# Altium schematic sheet Sheet_IRFS7530_bridges.SchDoc
size A
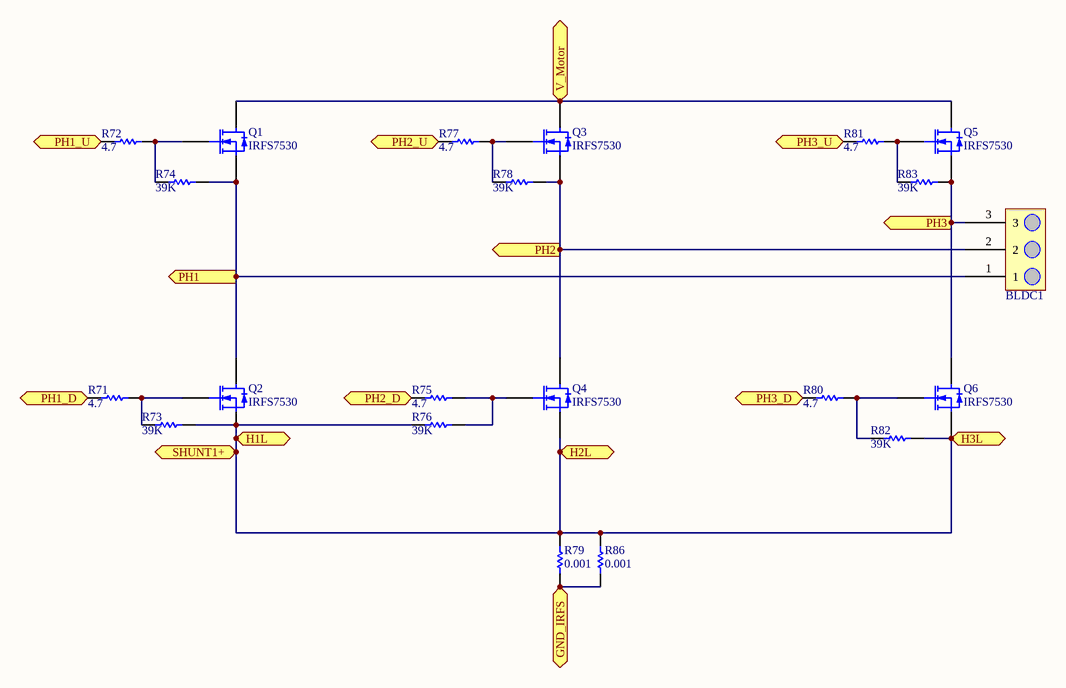
[diagram p0: Sheet_IRFS7530_bridges.SchDoc]

## Parts
BLDC1  Terminal3  [TERM3]  (value not drawn)
Q1  IRFS7530  [D2PAK-7Pin]
Q2  IRFS7530  [D2PAK-7Pin]
Q3  IRFS7530  [D2PAK-7Pin]
Q4  IRFS7530  [D2PAK-7Pin]
Q5  IRFS7530  [D2PAK-7Pin]
Q6  IRFS7530  [D2PAK-7Pin]
R71  4.7  [1608[0603]]
R72  4.7  [1608[0603]]
R73  39K  [1608[0603]]
R74  39K  [1608[0603]]
R75  4.7  [1608[0603]]
R76  39K  [1608[0603]]
R77  4.7  [1608[0603]]
R78  39K  [1608[0603]]
R79  0.001  [5931]
R80  4.7  [1608[0603]]
R81  4.7  [1608[0603]]
R82  39K  [1608[0603]]
R83  39K  [1608[0603]]
R86  0.001  [5931]

## Ports
GND_IRFS (bidir), H1L (out), H2L (out), H3L (out), PH1 (out), PH1_D (in), PH1_U (in), PH2 (out), PH2_D (in), PH2_U (in), PH3 (out), PH3_D (in), PH3_U (in), SHUNT1+ (out), V_Motor (bidir)

## Nets
GND_IRFS: R79.1 R86.1 ; port GND_IRFS
H1L: Q2.3(S) Q4.3(S) Q6.3(S) R73.2 R76.1 R79.2 R82.2 R86.2 ; port H1L, port SHUNT1+, port H2L, port H3L
PH1: BLDC1.1 Q1.3(S) Q2.2(D) R74.2 ; port PH1
PH1_D: R71.1 ; port PH1_D
PH1_U: R72.1 ; port PH1_U
PH2: BLDC1.2 Q3.3(S) Q4.2(D) R78.2 ; port PH2
PH2_D: R75.1 ; port PH2_D
PH2_U: R77.1 ; port PH2_U
PH3: BLDC1.3 Q5.3(S) Q6.2(D) R83.2 ; port PH3
PH3_D: R80.1 ; port PH3_D
PH3_U: R81.1 ; port PH3_U
V_Motor: Q1.2(D) Q3.2(D) Q5.2(D) ; port V_Motor
NetQ1_1: Q1.1(G) R72.2 R74.1
NetQ2_1: Q2.1(G) R71.2 R73.1
NetQ3_1: Q3.1(G) R77.2 R78.1
NetQ4_1: Q4.1(G) R75.2 R76.2
NetQ5_1: Q5.1(G) R81.2 R83.1
NetQ6_1: Q6.1(G) R80.2 R82.1

## Library data of the parts
BLDC1 = Terminal3: Connector; Value: ?
R71-R83 R86 = Res: Supplier 1: Digi-Key
  R71 R72 R75 R77 R80 R81: Value: 4.7; Supplier Part Number 1: 311-4.7GRCT-ND
  R73 R74 R76 R78 R82 R83: Value: 39K; Supplier Part Number 1: 311-39.0KHRDKR-ND
  R79 R86: Value: 0.001; Supplier Part Number 1: WSLPD-.001CT-ND
Q1-Q6 = IRFS7530: Supplier 1: Digi-Key; Supplier Part Number 1: IRFS7530-7PPBF-ND